# EAGLE design MC Board (EAGLE 9.0.1)
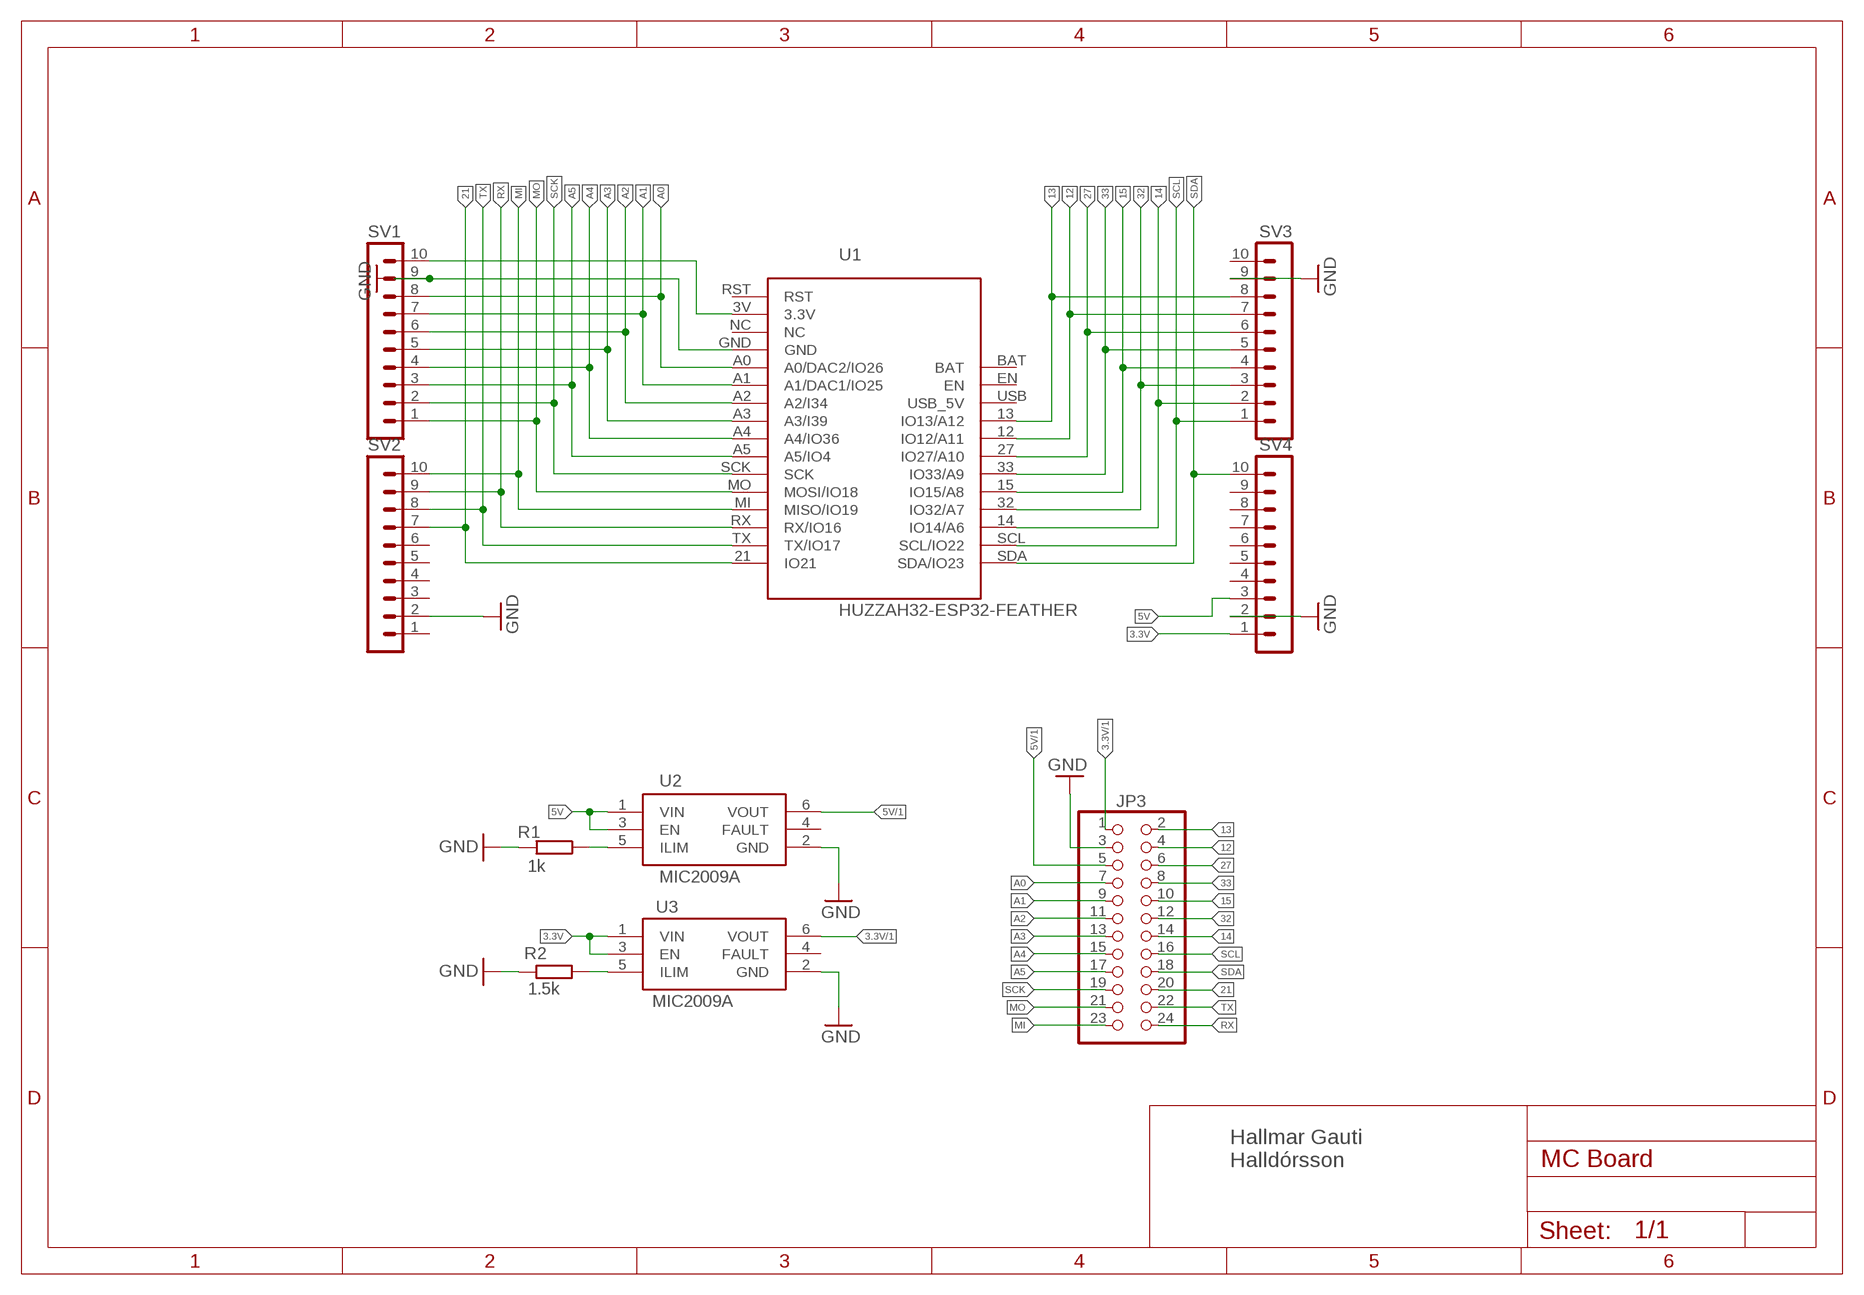
[diagram p0: schematic, sheet 1]

## Parts
JP3  PINHD-2X12/90  [2X12/90]
R1  1k  R-EU_M1206  [M1206]
R2  1.5k  R-EU_M1206  [M1206]
SV1  MA10-1  [MA10-1]
SV2  MA10-1  [MA10-1]
SV3  MA10-1  [MA10-1]
SV4  MA10-1  [MA10-1]
U1  HUZZAH32-ESP32-FEATHER  [ESP32-FEATHER]
U2  MIC2009A  [MIC2009A]
U3  MIC2009A  [MIC2009A]

## Nets
3.3V: SV4.1 U3.1(VIN) U3.3(EN)
3.3V/1: JP3.1 U3.6(VOUT)
5V: SV4.3 U2.1(VIN) U2.3(EN)
5V/1: JP3.5 U2.6(VOUT)
12: JP3.4 SV3.7 U1.12(IO12/A11)
13: JP3.2 SV3.8 U1.13(IO13/A12)
14: JP3.14 SV3.2 U1.14(IO14/A6)
15: JP3.10 SV3.4 U1.15(IO15/A8)
21: JP3.20 SV2.7 U1.21(IO21)
27: JP3.6 SV3.6 U1.27(IO27/A10)
32: JP3.12 SV3.3 U1.32(IO32/A7)
33: JP3.8 SV3.5 U1.33(IO33/A9)
A0: JP3.7 SV1.8 U1.A0(A0/DAC2/IO26)
A1: JP3.9 SV1.7 U1.A1(A1/DAC1/IO25)
A2: JP3.11 SV1.6 U1.A2(A2/I34)
A3: JP3.13 SV1.5 U1.A3(A3/I39)
A4: JP3.15 SV1.4 U1.A4(A4/IO36)
A5: JP3.17 SV1.3 U1.A5(A5/IO4)
GND: JP3.3 R1.2 R2.1 SV1.9 SV2.2 SV3.9 SV4.2 U1.GND U2.2(GND) U3.2(GND)
MI: JP3.23 SV2.10 U1.MI(MISO/IO19)
MO: JP3.21 SV1.1 U1.MO(MOSI/IO18)
N$1: SV1.10 U1.3V(3.3V)
N$43: R2.2 U3.5(ILIM)
N$44: R1.1 U2.5(ILIM)
RX: JP3.24 SV2.9 U1.RX(RX/IO16)
SCK: JP3.19 SV1.2 U1.SCK
SCL: JP3.16 SV3.1 U1.SCL(SCL/IO22)
SDA: JP3.18 SV4.10 U1.SDA(SDA/IO23)
TX: JP3.22 SV2.8 U1.TX(TX/IO17)
Unconnected: SV2.1 SV2.3 SV2.4 SV2.5 SV2.6 SV3.10 SV4.4 SV4.5 SV4.6 SV4.7 SV4.8 SV4.9 U1.BAT U1.EN U1.NC U1.RST U1.USB(USB_5V) U2.4(FAULT) U3.4(FAULT)

## Notes on the sheet
- Hallmar Gauti 
  Halldórsson

## Library data of the parts
JP3 = pinhead:PINHD-2X12: PIN HEADER
R1 R2 = resistor:R-EU_: RESISTOR, European symbol
SV1-SV4 = con-lstb:MA10-1: PIN HEADER; OC_FARNELL: unknown; OC_NEWARK: unknown
U1 = hallmar-lib:HUZZAH32-ESP32-FEATHER
U2 U3 = hallmar-lib:MIC2009A

## Board
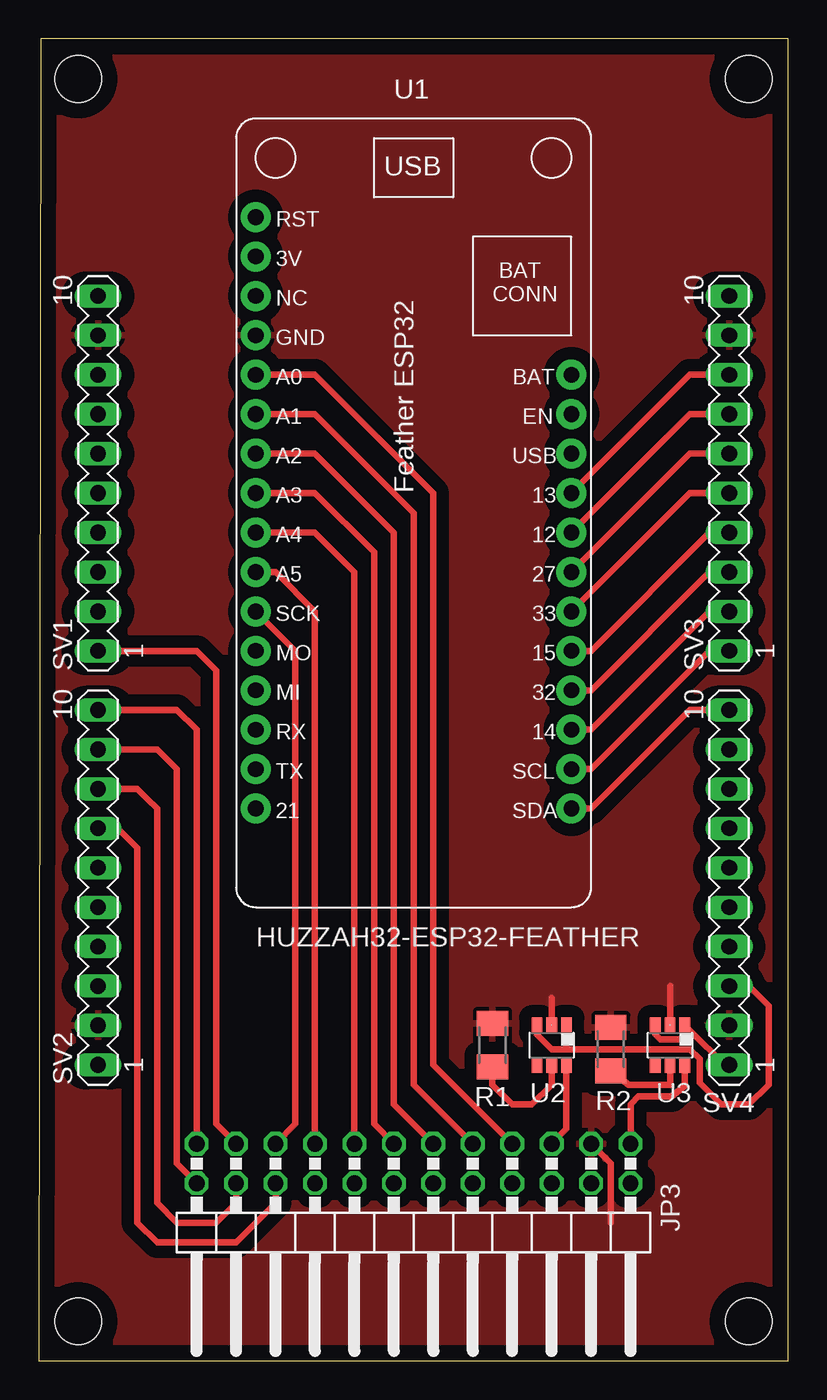
[diagram p1: board, top side]
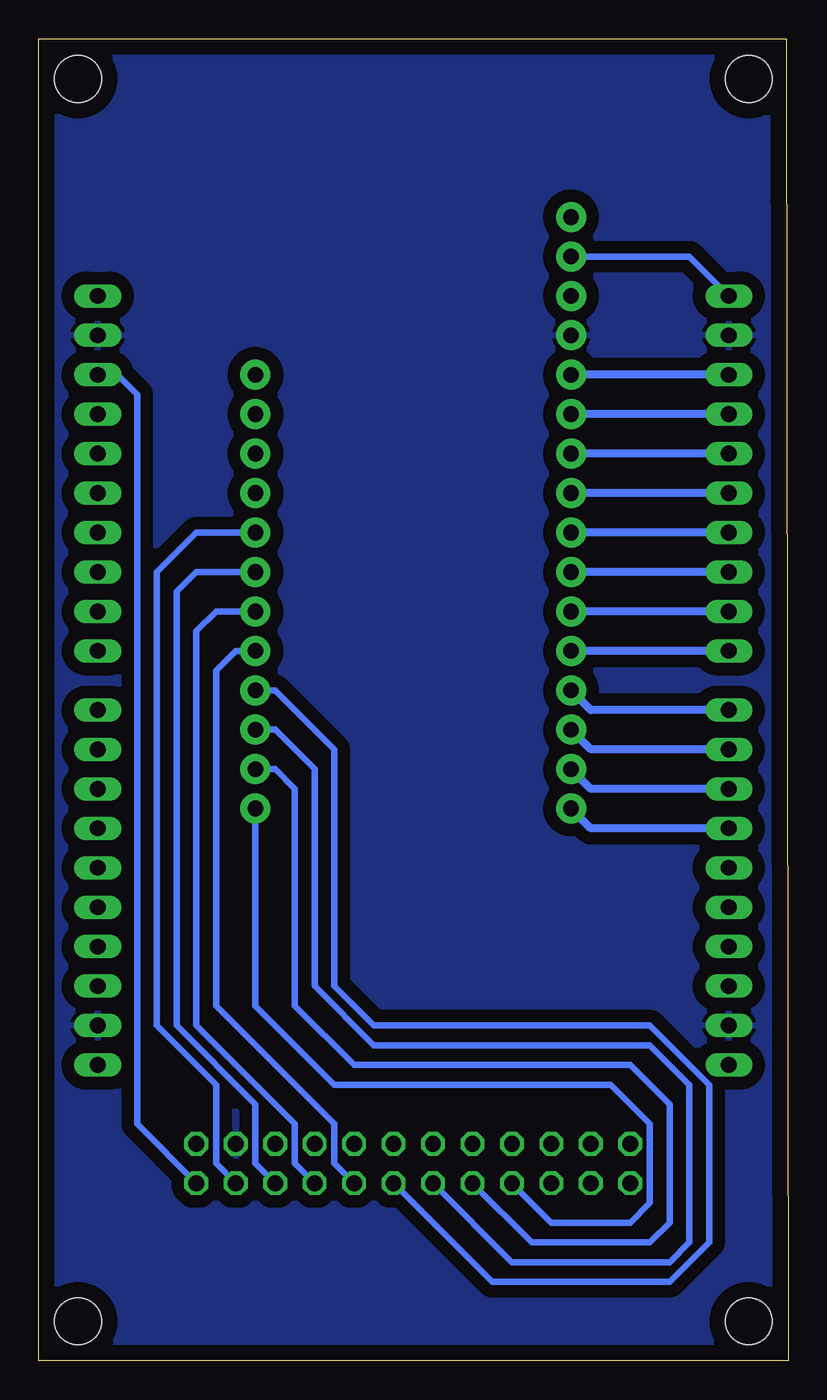
[diagram p2: board, bottom side, seen from below]

Size 48.24 x 85.14 mm. Coordinates in mm from the lower left corner, seen from the top.
Outline: 0,0 48.24,0 48.24,85.14 0.13,85.14 0,0
Copper layers (1*16): Top 0.035mm / dielectric 1.5mm / Bottom 0.035mm
Design rules "default": minimum track width 6mil, minimum drill 0.35mm, track to track 6mil, track to pad 6mil, pad to pad 6mil, via to via 6mil, smd to smd 6mil, copper to edge 40mil, drill to drill 6mil, minimum pad ring 10mil, minimum via ring 8mil, stop-mask expansion 4mil, vias tented up to drill 0mil, thermal gap 10mil
Holes 3 mm at 2.54,82.55 45.72,82.55 2.54,2.54 45.72,2.54

### Footprints (pad centres in the part's own frame; a part is rotated, then mirrored left to right if it is on the bottom)
2X12/90 = drill 1.016 octagon: 1 -13.97,-6.35; 2 -13.97,-3.81; 3 -11.43,-6.35; 4 -11.43,-3.81; 5 -8.89,-6.35; 6 -8.89,-3.81; 7 -6.35,-6.35; 8 -6.35,-3.81; 9 -3.81,-6.35; 10 -3.81,-3.81; 11 -1.27,-6.35; 12 -1.27,-3.81; 13 1.27,-6.35; 14 1.27,-3.81; 15 3.81,-6.35; 16 3.81,-3.81; 17 6.35,-6.35; 18 6.35,-3.81; 19 8.89,-6.35; 20 8.89,-3.81; 21 11.43,-6.35; 22 11.43,-3.81; 23 13.97,-6.35; 24 13.97,-3.81
M1206 = smd 1.6 x 2: 1 -1.4,0; 2 1.4,0
MA10-1 = drill 1.016 long: 1 -11.43,0; 2 -8.89,0; 3 -6.35,0; 4 -3.81,0; 5 -1.27,0; 6 1.27,0; 7 3.81,0; 8 6.35,0; 9 8.89,0; 10 11.43,0
ESP32-FEATHER = drill 1.016 pad 1.93: 3V -10.16,33.02; 12 10.16,15.24; 13 10.16,17.78; 14 10.16,2.54; 15 10.16,7.62; 21 -10.16,-2.54; 27 10.16,12.7; 32 10.16,5.08; 33 10.16,10.16; A0 -10.16,25.4; A1 -10.16,22.86; A2 -10.16,20.32; A3 -10.16,17.78; A4 -10.16,15.24; A5 -10.16,12.7; BAT 10.16,25.4; EN 10.16,22.86; GND -10.16,27.94; MI -10.16,5.08; MO -10.16,7.62; NC -10.16,30.48; RST -10.16,35.56; RX -10.16,2.54; SCK -10.16,10.16; SCL 10.16,0; SDA 10.16,-2.54; TX -10.16,0; USB 10.16,20.32
MIC2009A = smd 0.69 x 0.99: 1 -0.95,-1.29; 2 0,-1.29; 3 0.95,-1.29; 4 0.95,1.3; 5 0,1.3; 6 -0.95,1.3

### Placement (x,y rotation side)
JP3  24.13,7.62 180 top
R1  29.21,20.32 90 top
R2  36.83,20.07 270 top
SV1  3.81,57.15 90 top
SV2  3.81,30.48 90 top
SV3  44.45,57.15 90 top
SV4  44.45,30.48 90 top
U1  24.13,38.1 0 top
U2  33.02,20.32 180 top
U3  40.64,20.32 180 top

### Tracks (layer width: path | path; a pad name or v marks a point on that pad's centre or on a via)
3.3V
  Top 0.406: U3.1 41.95,21.25 | U3.3 39.69,21.02 40.01,20.7 41.27,20.7 41.82,21.25 41.95,21.25 | SV4.1 44.15,19.05 41.95,21.25
3.3V/1
  Top 0.406: U3.6 41.59,17.71 40.76,17.02 38.61,17.02 38.1,16.51 JP3.1
5V
  Top 0.406: 33.91,20.07 33.02,20.07 32.07,21.02 U2.3 | 33.91,20.07 41.91,20.07 42.55,19.43 42.55,17.91 43.94,16.51 45.72,16.51 46.99,17.78 46.99,22.86 45.72,24.13 SV4.3 | U2.1 33.97,20.13 33.91,20.07
5V/1
  Top 0.406: U2.6 33.97,14.92 JP3.5
12
  Top 0.406: U1.12 41.91,60.96 SV3.7
  Bottom 0.406: JP3.4 36.83,12.7 36.83,17.78 40.64,21.59 40.64,50.8 38.1,53.34 U1.12
13
  Top 0.406: U1.13 41.91,63.5 SV3.8
  Bottom 0.406: JP3.2 41.91,15.24 41.91,62.23 43.18,63.5 SV3.8
14
  Top 0.406: U1.14 35.56,40.64 43.18,48.26 SV3.2
  Bottom 0.406: JP3.14 17.78,6.35 7.62,6.35 6.35,7.62 6.35,17.78 8.89,20.32 26.67,20.32 30.48,24.13 30.48,38.1 33.02,40.64 U1.14
15
  Top 0.406: U1.15 35.56,45.72 43.18,53.34 SV3.4
  Bottom 0.406: JP3.10 29.21,12.7 29.21,15.24 36.83,22.86 36.83,44.45 35.56,45.72 U1.15
21
  Top 0.406: JP3.20 15.24,10.16 12.7,7.62 7.62,7.62 6.35,8.89 6.35,33.02 5.08,34.29 SV2.7
  Bottom 0.508: SV2.7 12.7,34.29 U1.21
27
  Top 0.406: U1.27 41.91,58.42 SV3.6
  Bottom 0.406: JP3.6 34.29,12.7 34.29,16.51 39.37,21.59 39.37,49.53 38.1,50.8 U1.27
32
  Top 0.406: U1.32 35.56,43.18 43.18,50.8 SV3.3
  Bottom 0.406: JP3.12 19.05,5.08 7.62,5.08 5.08,7.62 5.08,17.78 8.89,21.59 26.67,21.59 29.21,24.13 29.21,39.37 33.02,43.18 U1.32
33
  Top 0.406: U1.33 41.91,55.88 SV3.5
  Bottom 0.406: JP3.8 31.75,12.7 31.75,15.24 38.1,21.59 38.1,46.99 36.83,48.26 U1.33
A0
  Top 0.406: JP3.7 25.4,19.05 25.4,55.88 17.78,63.5 U1.A0
  Bottom 0.508: SV1.8 U1.A0
A1
  Top 0.406: JP3.9 24.13,17.78 24.13,54.61 17.78,60.96 U1.A1
  Bottom 0.508: SV1.7 U1.A1
A2
  Top 0.406: JP3.11 22.86,16.51 22.86,53.34 17.78,58.42 U1.A2
  Bottom 0.508: SV1.6 U1.A2
A3
  Top 0.406: JP3.13 21.59,15.24 21.59,52.07 17.78,55.88 U1.A3
  Bottom 0.508: SV1.5 U1.A3
A4
  Top 0.406: JP3.15 20.32,50.8 17.78,53.34 U1.A4
  Bottom 0.508: SV1.4 U1.A4
A5
  Top 0.406: JP3.17 17.78,48.26 15.24,50.8 U1.A5
  Bottom 0.508: SV1.3 U1.A5
GND
  Top 0.406: U2.2 33.02,23.37 | U3.2 40.64,24.13 | JP3.3 36.83,12.7 36.83,8.89
  pour Bottom (isolate 0.813): 0,85.09 48.26,85.09 48.26,0 0,0
  pour Top (isolate 0.813): 48.26,85.09 0,85.09 0,0 48.26,0
MI
  Top 0.406: JP3.23 10.16,40.64 8.89,41.91 SV2.10
  Bottom 0.508: SV2.10 12.7,41.91 U1.MI
MO
  Top 0.406: JP3.21 11.43,15.24 11.43,44.45 10.16,45.72 SV1.1
  Bottom 0.508: SV1.1 U1.MO
N$1
  Bottom 0.406: U1.3V 6.35,71.12 SV1.10
N$43
  Top 0.406: R2.2 37.97,17.78 40.64,17.78 U3.5
N$44
  Top 0.406: U2.5 33.02,17.78 31.75,16.51 30.48,16.51 29.21,17.78 R1.1
RX
  Top 0.406: JP3.24 8.89,12.7 8.89,38.1 7.62,39.37 SV2.9
  Bottom 0.508: SV2.9 12.7,39.37 U1.RX
SCK
  Top 0.406: JP3.19 16.51,15.24 16.51,45.72 U1.SCK
  Bottom 0.508: SV1.2 U1.SCK
SCL
  Top 0.406: U1.SCL 35.56,38.1 43.18,45.72 SV3.1
  Bottom 0.406: JP3.16 16.51,7.62 8.89,7.62 7.62,8.89 7.62,16.51 10.16,19.05 27.94,19.05 31.75,22.86 31.75,36.83 33.02,38.1 U1.SCL
SDA
  Top 0.406: U1.SDA 35.56,35.56 41.91,41.91 SV4.10
  Bottom 0.406: JP3.18 15.24,8.89 10.16,8.89 8.89,10.16 8.89,15.24 11.43,17.78 29.21,17.78 34.29,22.86 U1.SDA
TX
  Top 0.406: JP3.22 12.7,10.16 11.43,8.89 8.89,8.89 7.62,10.16 7.62,35.56 6.99,36.2 6.35,36.83 SV2.8
  Bottom 0.508: SV2.8 12.7,36.83 U1.TX